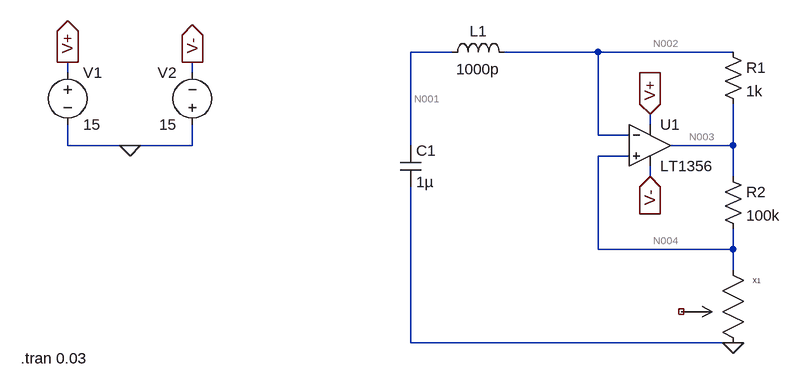
[diagram p0: schematic Oscillator.asc]
Oscillator.asc, the LTspice schematic file:
Version 4
SHEET 1 880 680
WIRE -64 -96 -128 -96
WIRE 160 -96 16 -96
WIRE 368 -96 160 -96
WIRE -656 -64 -656 -80
WIRE -464 -64 -464 -80
WIRE 240 16 240 0
WIRE 160 32 160 -96
WIRE 208 32 160 32
WIRE -656 48 -656 16
WIRE -560 48 -656 48
WIRE -464 48 -464 16
WIRE -464 48 -560 48
WIRE -128 48 -128 -96
WIRE 368 48 368 -16
WIRE 368 48 272 48
WIRE 208 64 160 64
WIRE 240 96 240 80
WIRE 368 96 368 48
WIRE 160 208 160 64
WIRE 368 208 368 176
WIRE 368 208 160 208
WIRE 368 240 368 208
WIRE -128 352 -128 112
WIRE 368 352 -128 352
FLAG -656 -80 V+
IOPIN -656 -80 Out
FLAG -464 -80 V-
IOPIN -464 -80 Out
FLAG -560 48 0
FLAG 368 352 0
FLAG 240 0 V+
IOPIN 240 0 In
FLAG 240 96 V-
IOPIN 240 96 In
SYMBOL pot 352 256 R0
SYMATTR InstName X1
SYMBOL res 352 -112 R0
SYMATTR InstName R1
SYMATTR Value 1k
SYMBOL res 352 80 R0
SYMATTR InstName R2
SYMATTR Value 100k
SYMBOL OpAmps\\LT1356 240 -16 R0
SYMATTR InstName U1
SYMBOL cap -144 48 R0
SYMATTR InstName C1
SYMATTR Value 1µ
SYMBOL ind -80 -80 R270
WINDOW 0 32 56 VTop 2
WINDOW 3 5 56 VBottom 2
SYMATTR InstName L1
SYMATTR Value 1000p
SYMBOL voltage -656 -80 R0
WINDOW 123 0 0 Left 0
WINDOW 39 0 0 Left 0
SYMATTR InstName V1
SYMATTR Value 15
SYMBOL voltage -464 32 R180
WINDOW 0 24 96 Left 2
WINDOW 3 24 16 Left 2
WINDOW 123 0 0 Left 0
WINDOW 39 0 0 Left 0
SYMATTR InstName V2
SYMATTR Value 15
TEXT -728 376 Left 2 !.tran 0.03

The netlist it stands for:
* Oscillator.asc
XX1 N004 NC_01 0 pot R=10k Val=50  ; pins 1 2 3
R1 N002 N003 1k
R2 N003 N004 100k
XU1 N004 N002 V+ V- N003 LT1356  ; pins In+ In- V+ V- OUT
C1 N001 0 1µ
L1 N001 N002 1000p
V1 V+ 0 15
V2 0 V- 15
.tran 0.03
.backanno
.end

* Results of the author's LTspice run, read from the files saved beside the schematic
* Operating Point, zero values left out:
*   V(n004) = -797.9 µV
*   V(n002) = -797.9 µV
*   V(n003) = -717.3 µV
*   V(v+) = 15 V
*   V(v-) = -15 V
*   V(n001) = -797.9 µV
*   I(R2) = 806.1 pA
*   I(R1) = -80.6 nA
*   I(V2) = -994.3 µA
*   I(V1) = -994.2 µA
*   Ix(x1:1) = -79.79 nA
*   Ix(x1:3) = 79.79 nA
*   Ix(u1:1) = 80.6 nA
*   Ix(u1:2) = 80.6 nA
*   Ix(u1:3) = 994.2 µA
*   Ix(u1:4) = -994.3 µA
*   Ix(u1:5) = -81.4 nA
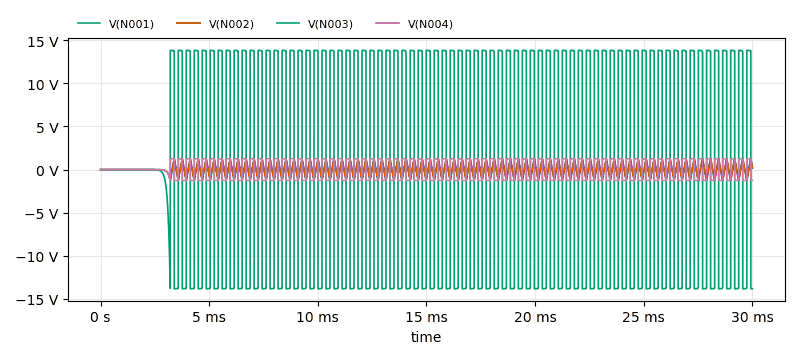
[diagram p1: Transient Analysis of Oscillator.asc, plotted from the saved traces]
* Transient Analysis, 1 run:
*   V(N001): min -1.334 V, max 1.345 V, average -2.33 mV, rms 745.4 mV, last 200.4 mV
*   V(N002): min -1.334 V, max 1.345 V, average -2.33 mV, rms 745.4 mV, last 200.4 mV
*   V(N003): min -13.82 V, max 13.82 V, average 3.58 mV, rms 13.04 V, last -13.81 V
*   V(N004): min -1.255 V, max 1.254 V, average -401.2 µV, rms 1.185 V, last -1.255 V